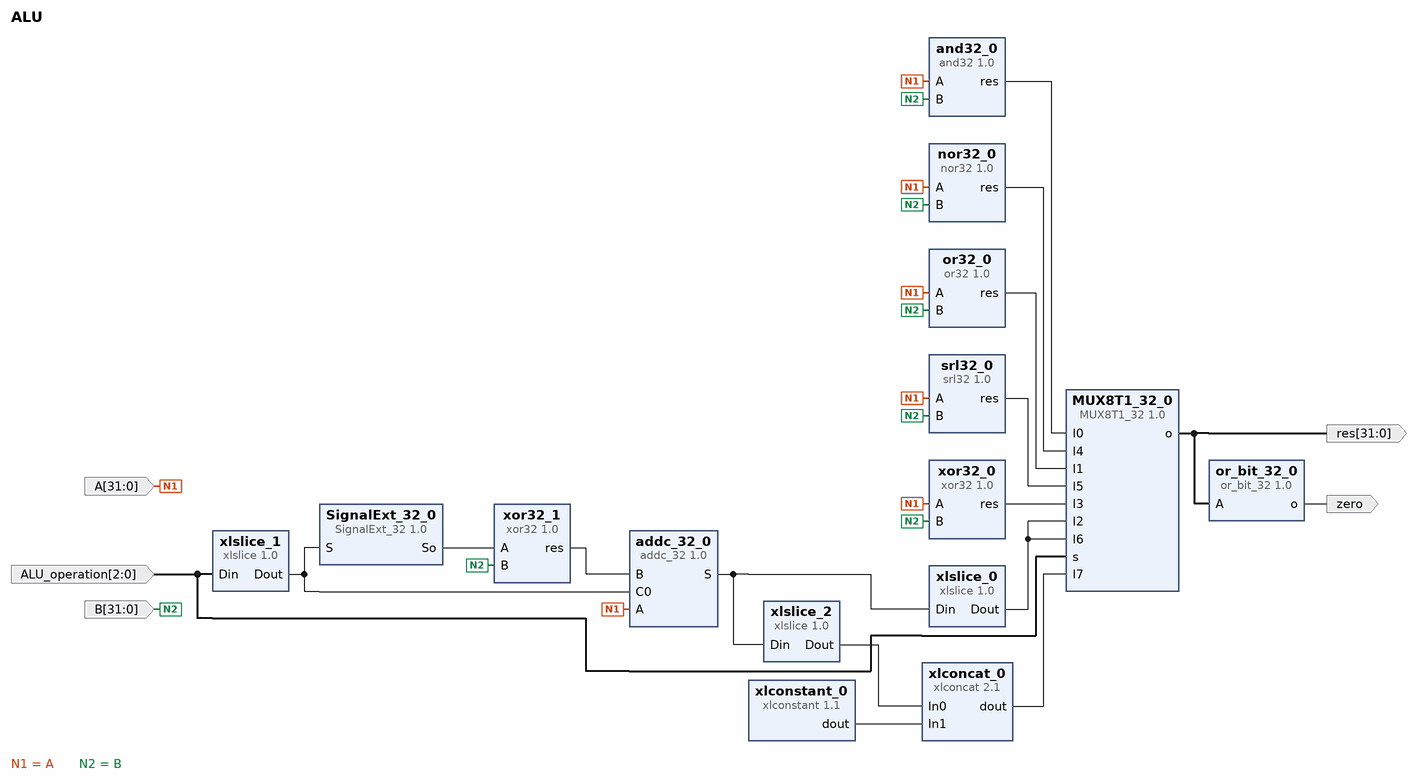
[diagram p0: block diagram of the top level]
# Vivado block design ALU, xc7k160tffg676-2L, Vivado 2023.2
create_bd_design ALU

create_bd_port -dir I -from 31 -to 0 A
create_bd_port -dir I -from 31 -to 0 B
create_bd_port -dir I -from 2 -to 0 ALU_operation
create_bd_port -dir O -from 31 -to 0 res
create_bd_port -dir O zero

create_bd_cell -type ip -vlnv xilinx.com:user:MUX8T1_32:1.0 MUX8T1_32_0
create_bd_cell -type ip -vlnv xilinx.com:user:and32:1.0 and32_0
create_bd_cell -type ip -vlnv xilinx.com:user:or32:1.0 or32_0
create_bd_cell -type ip -vlnv xilinx.com:ip:xlslice:1.0 xlslice_0
set_property -dict {CONFIG.DIN_FROM 31 CONFIG.DIN_WIDTH 33} [get_bd_cells xlslice_0]
create_bd_cell -type ip -vlnv xilinx.com:user:xor32:1.0 xor32_0
create_bd_cell -type ip -vlnv xilinx.com:user:nor32:1.0 nor32_0
create_bd_cell -type ip -vlnv xilinx.com:user:srl32:1.0 srl32_0
create_bd_cell -type ip -vlnv xilinx.com:user:addc_32:1.0 addc_32_0
create_bd_cell -type ip -vlnv xilinx.com:ip:xlconcat:2.1 xlconcat_0
set_property -dict {CONFIG.IN1_WIDTH 31} [get_bd_cells xlconcat_0]
create_bd_cell -type ip -vlnv xilinx.com:user:SignalExt_32:1.0 SignalExt_32_0
create_bd_cell -type ip -vlnv xilinx.com:user:xor32:1.0 xor32_1
create_bd_cell -type ip -vlnv xilinx.com:ip:xlslice:1.0 xlslice_1
set_property -dict {CONFIG.DIN_FROM 2 CONFIG.DIN_TO 2 CONFIG.DIN_WIDTH 3} [get_bd_cells xlslice_1]
create_bd_cell -type ip -vlnv xilinx.com:ip:xlslice:1.0 xlslice_2
set_property -dict {CONFIG.DIN_FROM 32 CONFIG.DIN_TO 32 CONFIG.DIN_WIDTH 33} [get_bd_cells xlslice_2]
create_bd_cell -type ip -vlnv xilinx.com:ip:xlconstant:1.1 xlconstant_0
set_property -dict {CONFIG.CONST_VAL 0 CONFIG.CONST_WIDTH 31} [get_bd_cells xlconstant_0]
create_bd_cell -type ip -vlnv xilinx.com:user:or_bit_32:1.0 or_bit_32_0

# ---- connections ----

connect_bd_net -net A_0_1 [get_bd_ports A] \
  [get_bd_pins and32_0/A] [get_bd_pins or32_0/A] [get_bd_pins nor32_0/A] [get_bd_pins addc_32_0/A] [get_bd_pins srl32_0/A] \
  [get_bd_pins xor32_0/A]
connect_bd_net [get_bd_ports B] \
  [get_bd_pins and32_0/B] [get_bd_pins or32_0/B] [get_bd_pins xor32_0/B] [get_bd_pins nor32_0/B] [get_bd_pins srl32_0/B] \
  [get_bd_pins xor32_1/B]
connect_bd_net -net Din_0_1 [get_bd_ports ALU_operation] [get_bd_pins xlslice_1/Din] [get_bd_pins MUX8T1_32_0/s]
connect_bd_net [get_bd_pins MUX8T1_32_0/o] [get_bd_ports res] [get_bd_pins or_bit_32_0/A]
connect_bd_net [get_bd_pins SignalExt_32_0/So] [get_bd_pins xor32_1/A]
connect_bd_net [get_bd_pins addc_32_0/S] [get_bd_pins xlslice_0/Din] [get_bd_pins xlslice_2/Din]
connect_bd_net [get_bd_pins and32_0/res] [get_bd_pins MUX8T1_32_0/I0]
connect_bd_net [get_bd_pins nor32_0/res] [get_bd_pins MUX8T1_32_0/I4]
connect_bd_net [get_bd_pins or32_0/res] [get_bd_pins MUX8T1_32_0/I1]
connect_bd_net [get_bd_pins or_bit_32_0/o] [get_bd_ports zero]
connect_bd_net [get_bd_pins srl32_0/res] [get_bd_pins MUX8T1_32_0/I5]
connect_bd_net [get_bd_pins xlconcat_0/dout] [get_bd_pins MUX8T1_32_0/I7]
connect_bd_net [get_bd_pins xlconstant_0/dout] [get_bd_pins xlconcat_0/In1]
connect_bd_net [get_bd_pins xlslice_0/Dout] [get_bd_pins MUX8T1_32_0/I2] [get_bd_pins MUX8T1_32_0/I6]
connect_bd_net [get_bd_pins xlslice_1/Dout] [get_bd_pins SignalExt_32_0/S] [get_bd_pins addc_32_0/C0]
connect_bd_net [get_bd_pins xlslice_2/Dout] [get_bd_pins xlconcat_0/In0]
connect_bd_net [get_bd_pins xor32_0/res] [get_bd_pins MUX8T1_32_0/I3]
connect_bd_net [get_bd_pins xor32_1/res] [get_bd_pins addc_32_0/B]

validate_bd_design
save_bd_design
